# Altium project AD_info.PrjPcb (part 2 of 2)

## Sheet [4] Ports.SchDoc
size A4
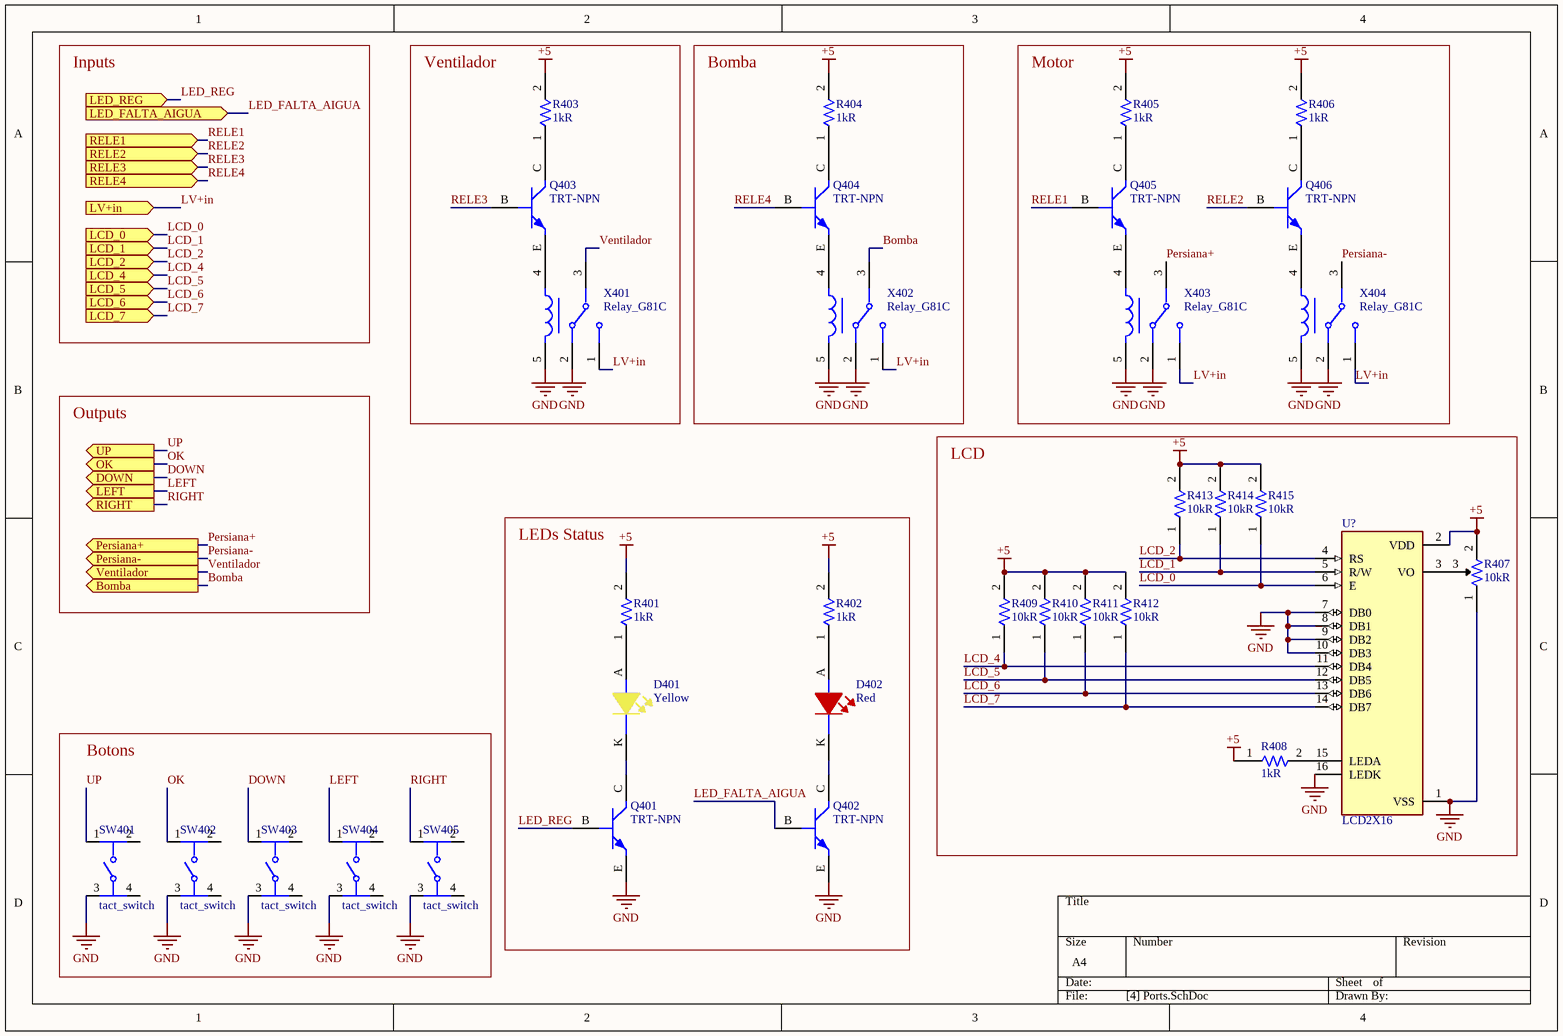
[diagram p4: [4] Ports.SchDoc]

### Parts
D401  Color: Yellow  [LED_3528-WE]  (hidden comment: 150141YS73100)
D402  Color: Red  [LED_3528-WE]  (hidden comment: 150141RS73100)
Q401  TRT-NPN  [TRT-NPN-0.5/45-SOT23]
Q402  TRT-NPN  [TRT-NPN-0.5/45-SOT23]
Q403  TRT-NPN  [TRT-NPN-0.5/45-SOT23]
Q404  TRT-NPN  [TRT-NPN-0.5/45-SOT23]
Q405  TRT-NPN  [TRT-NPN-0.5/45-SOT23]
Q406  TRT-NPN  [TRT-NPN-0.5/45-SOT23]
R401  Resistance: 1kR  [R1206FTK-W]  (hidden comment: ERJT08J102V)
R402  Resistance: 1kR  [R1206FTK-W]  (hidden comment: ERJT08J102V)
R403  Resistance: 1kR  [R1206FTK-W]  (hidden comment: ERJT08J102V)
R404  Resistance: 1kR  [R1206FTK-W]  (hidden comment: ERJT08J102V)
R405  Resistance: 1kR  [R1206FTK-W]  (hidden comment: ERJT08J102V)
R406  Resistance: 1kR  [R1206FTK-W]  (hidden comment: ERJT08J102V)
R407  Resistance: 10kR  [R10k-VTR]  (hidden comment: 3296W-1-103LF)
R408  Resistance: 1kR  [R1206FTK-W]  (hidden comment: ERJT08J102V)
R409  Resistance: 10kR  [R1206FTK-W]  (hidden comment: CRCW120610K0FKEA)
R410  Resistance: 10kR  [R1206FTK-W]  (hidden comment: CRCW120610K0FKEA)
R411  Resistance: 10kR  [R1206FTK-W]  (hidden comment: CRCW120610K0FKEA)
R412  Resistance: 10kR  [R1206FTK-W]  (hidden comment: CRCW120610K0FKEA)
R413  Resistance: 10kR  [R1206FTK-W]  (hidden comment: CRCW120610K0FKEA)
R414  Resistance: 10kR  [R1206FTK-W]  (hidden comment: CRCW120610K0FKEA)
R415  Resistance: 10kR  [R1206FTK-W]  (hidden comment: CRCW120610K0FKEA)
SW401  tact_switch  [FP-PTS647SK38SMTR2LFS-MFG]
SW402  tact_switch  [FP-PTS647SK38SMTR2LFS-MFG]
SW403  tact_switch  [FP-PTS647SK38SMTR2LFS-MFG]
SW404  tact_switch  [FP-PTS647SK38SMTR2LFS-MFG]
SW405  tact_switch  [FP-PTS647SK38SMTR2LFS-MFG]
U?  LCD2X16  [LCD_LCD2X16]
X401  Relay_G81C  [Relay_G81C]
X402  Relay_G81C  [Relay_G81C]
X403  Relay_G81C  [Relay_G81C]
X404  Relay_G81C  [Relay_G81C]

### Blocks framed on the sheet
Ventilador: Q403 R403 X401
Bomba: Q404 R404 X402
Motor: Q405 Q406 R405 R406 X403 X404
LCD: R407-R415 U?
LEDs Status: D401 D402 Q401 Q402 R401 R402
Botons: SW401-SW405

### Ports
Bomba (out, see AD_info[1B]), DOWN (out, see AD_info[1B], [2] MCU[1B]), LCD_0 (in, see AD_info[1B], [2] MCU[1C]), LCD_1 (in, see AD_info[1B], [2] MCU[1C]), LCD_2 (in, see AD_info[1B], [2] MCU[1C]), LCD_4 (in, see AD_info[1B], [2] MCU[1C]), LCD_5 (in, see AD_info[1B], [2] MCU[1C]), LCD_6 (in, see AD_info[1B], [2] MCU[1C]), LCD_7 (in, see AD_info[1B], [2] MCU[1C]), LED_FALTA_AIGUA (in, see AD_info[1B], [2] MCU[1C]), LED_REG (in, see AD_info[1B], [2] MCU[1C]), LEFT (out, see AD_info[1B], [2] MCU[1B]), LV+in (in, see AD_info[1B], [1] Supply[1A]), OK (out, see AD_info[1B], [2] MCU[1B]), Persiana+ (out, see AD_info[1B]), Persiana- (out, see AD_info[1B]), RELE1 (in, see AD_info[1B], [2] MCU[1B]), RELE2 (in, see AD_info[1B]), RELE3 (in, see AD_info[1B]), RELE4 (in, see AD_info[1B]), RIGHT (out, see AD_info[1B], [2] MCU[1B]), UP (out, see AD_info[1B], [2] MCU[1B]), Ventilador (out, see AD_info[1B])

### Nets
+5: R401.2 R402.2 R403.2 R404.2 R405.2 R406.2 R407.2 R408.1 R409.2 R410.2 R411.2 R412.2 R413.2 R414.2 R415.2 U?.2(VDD)  [project net +5V]
GND: Q401.E Q402.E R407.1 SW401.3 SW402.3 SW403.3 SW404.3 SW405.3 U?.1(VSS) U?.7(DB0) U?.8(DB1) U?.9(DB2) U?.10(DB3) U?.16(LEDK) X401.2 X401.5 X402.2 X402.5 X403.2 X403.5 X404.2 X404.5
LV+in: X401.1 X402.1 X403.1 X404.1 ; port LV+in
Bomba: X402.3 ; port Bomba
DOWN: SW403.1 ; port DOWN
LCD_0: R415.1 U?.6(E) ; port LCD_0
LCD_1: R414.1 U?.5(R/W) ; port LCD_1
LCD_2: R413.1 U?.4(RS) ; port LCD_2
LCD_4: R409.1 U?.11(DB4) ; port LCD_4
LCD_5: R410.1 U?.12(DB5) ; port LCD_5
LCD_6: R411.1 U?.13(DB6) ; port LCD_6
LCD_7: R412.1 U?.14(DB7) ; port LCD_7
LED_FALTA_AIGUA: Q402.B ; port LED_FALTA_AIGUA
LED_REG: Q401.B ; port LED_REG
LEFT: SW404.1 ; port LEFT
OK: SW402.1 ; port OK
Persiana+: X403.3 ; port Persiana+
Persiana-: X404.3 ; port Persiana-
RELE1: Q405.B ; port RELE1
RELE2: Q406.B ; port RELE2
RELE3: Q403.B ; port RELE3
RELE4: Q404.B ; port RELE4  [project net RELE2]
RIGHT: SW405.1 ; port RIGHT
UP: SW401.1 ; port UP
Ventilador: X401.3 ; port Ventilador
NetD401_A: D401.A R401.1
NetD401_K: D401.K Q401.C
NetD402_A: D402.A R402.1
NetD402_K: D402.K Q402.C
NetQ403_C: Q403.C R403.1
NetQ403_E: Q403.E X401.4
NetQ404_C: Q404.C R404.1
NetQ404_E: Q404.E X402.4
NetQ405_C: Q405.C R405.1
NetQ405_E: Q405.E X403.4
NetQ406_C: Q406.C R406.1
NetQ406_E: Q406.E X404.4
NetR407_3: R407.3 U?.3(VO)
NetR408_2: R408.2 U?.15(LEDA)

Not connected (* = marked no-connect by the designer): SW401 2 4; SW402 2 4; SW403 2 4; SW404 2 4; SW405 2 4

### Notes on the sheet
- Inputs
- Outputs

### Library data of the parts
D401 = LEDYS-3528-260: Led, Yellow, 590 Nm, 2 V, 30 Ma, 300 Mcd Rohs Compliant: Yes; Manufacturer: Wurth Electronics; Viewing Angle: 120°; Lens Style: Clear,Round; Wavelength: 590nm; Luminous Intensity: 300mcd; Forward Voltage: 2V; Forward Current: 30mA; Test Current: 20mA; .Creator: GP; Category: Diode LED; ComponentLink1Description: Datasheet; ComponentLink1URL: https://www.we-online.com/catalog/datasheet/150141YS73100.pdf; ComponentLink2Description: Where buy it; ComponentLink2URL: https://www.we-online.com/catalog/en/WL-SMTW?sq=150141GS73100#150141GS73100; Supplier 1: RSComponents; Manufacturer Part Number: 150141YS73100; RoHS: Yes; Stock 1: 1; Pricing 1: 100=0,18000, 200=0,17000, 500=0,12400, 1000=0,11900, 2000=0,11200 (USD); Mount: Surface Mount; Case/Package: 3528; Number of Pins: 2; Min Operating Temperature: -40°C; Max Operating Temperature: 85°C; Package Quantity: 2000; Packaging: Tape and Reel; Dominant Wavelength: 590nm; Length: 3.2mm; Width: 2.8mm; Height: 2.1mm; REACH SVHC: Unknown; RoHS Compliant: Yes; Supplier Part Number 1: 8154322
D402 = LEDRS-1411-300: Led, Red, 625 Nm, 2 V, 30 Ma, 300 Mcd Rohs Compliant: Yes; Manufacturer: Wurth Electronics; Luminous Intensity: 300mcd; Viewing Angle: 120°; Forward Voltage: 2V; Lens Style: Clear,Round; Wavelength: 625nm; Forward Current: 30mA; Test Current: 20mA; .Creator: GP; Category: Diode LED; ComponentLink1Description: Datasheet; ComponentLink1URL: https://www.we-online.com/catalog/datasheet/150141RS73100.pdf; ComponentLink2Description: Where buy it; ComponentLink2URL: https://www.we-online.com/catalog/en/WL-SMTW?sq=150141RS73100#150141RS73100; Supplier 1: Digi-Key; Manufacturer Part Number: 150141RS73100; RoHS: Yes; Stock 1: 6040; Pricing 1: 1=0,19000, 50=0,18200, 100=0,15800, 500=0,12100 (USD); Mount: Surface Mount; Case/Package: 3528; Case Code (Metric): 3528; Case Code (Imperial): 1411; Min Operating Temperature: -40°C; Max Operating Temperature: 85°C; Package Quantity: 2000; Packaging: Tape and Reel; Dominant Wavelength: 625nm; Length: 3.5mm; Width: 2.8mm; Height: 1.9mm; RoHS Compliant: Yes; REACH SVHC: Unknown; Supplier Part Number 1: 732-5000-1-ND
Q401-Q406 = CMP-00148-1: ON Semi BC817-25LT1G NPN Bipolar Transistor; 0.5 A; 45 V; 3-Pin SOT-23; Current Rating: 500mA; Collector-emitter Voltage-Max: 700mV; Gain Bandwidth Product: 100MHz; Element Configuration: Single; hFE Min: 160; Collector Emitter Voltage (VCEO): 45V; Emitter Base Voltage (VEBO): 5V; Collector Base Voltage (VCBO): 50V; Power Dissipation: 300mW; .Creator: GP; Number of Elements: 1; ComponentLink2URL: *; Packaging: *; ComponentLink14Description: https://datasheet.ciiva.com/976/bc817-16lt1-d-976357.pdf?src-supplier=Digi-Key; Radiation Hardening: No; Pricing 1: 1=0,20000, 10=0,18500, 100=0,10080, 500=0,06204, 1000=0,04229 (USD); ComponentLink9URL: https://datasheet.ciiva.com/4722/bc817-16lt1-d-104560-4722229.pdf?src-supplier=Mouser; Vce max: *; Gain: *; Max Power Dissipation: *; ComponentLink5URL: https://datasheet.ciiva.com/1196/bc817-16lt1-d-1196558.pdf?src-supplier=Element14; ComponentLink16URL: https://datasheet.ciiva.com/976/bc817-16lt1-d-976356.pdf?src-supplier=Digi-Key; Contact Plating: Tin,Matte; Max Operating Temperature: *; Package: *; Width: 1.3mm; ComponentLink2Description: Where buy it; ComponentLink15URL: https://datasheet.ciiva.com/976/bc817-16lt1-d-976358.pdf?src-supplier=Digi-Key; Package Quantity: 1; RoHS: *; Collector Emitter Saturation Voltage: 700mV; Transition Frequency: 100MHz; ComponentLink7URL: https://datasheet.ciiva.com/22664/bc817-16lt1-d-22664204.pdf?src-supplier=Element14; ComponentLink10URL: https://datasheet.ciiva.com/1195/bc817-16lt1-d-1195763.pdf?src-supplier=Element14; Design Item ID: TRT-NPN-0.5/45-SOT23; Series: -; ComponentLink8URL: https://datasheet.ciiva.com/22664/1842041-22664101.pdf?src-supplier=Element14; Lead Free: Lead Free; ComponentLink4Description: https://datasheet.ciiva.com/15138/getdatasheetpartid-38405-15138602.pdf?src-supplier=Verical; ComponentLink12Description: https://datasheet.ciiva.com/11197/bc817-16lt1-d-11197514.pdf?src-supplier=Avnet; ComponentLink11Description: https://datasheet.ciiva.com/1195/bc817-16lt1-d-1195764.pdf?src-supplier=Element14; Max Frequency: 100MHz; ComponentLink13URL: https://datasheet.ciiva.com/25996/bc817-16lt1-d-25996327.pdf?src-supplier=Avnet+Europe; Max Breakdown Voltage: 45V; Polarity: *; ComponentLink6URL: https://datasheet.ciiva.com/22641/bc817-16lt1-d-22641013.pdf?src-supplier=Farnell; ComponentLink4URL: https://datasheet.ciiva.com/15138/getdatasheetpartid-38405-15138602.pdf?src-supplier=Verical; Height: 0.94mm; Power rating: *; Source: Semiconductor.SchLib; Max Collector Current: 500mA; ComponentLink15Description: https://datasheet.ciiva.com/976/bc817-16lt1-d-976358.pdf?src-supplier=Digi-Key; ComponentLink11URL: https://datasheet.ciiva.com/1195/bc817-16lt1-d-1195764.pdf?src-supplier=Element14; REACH SVHC: No SVHC; Number of Pins: 3; Manufacturer Part Number: *; Case/Package: SOT-23-3; ComponentLink1Description: Datasheet; RoHS Compliant: Yes; Collector Emitter Breakdown Voltage: 45V; Halogen Free: Halogen Free; Frequency: 100MHz; ComponentLink3Description: https://datasheet.ciiva.com/27748/2010413-27748829.pdf?src-supplier=Jameco; ComponentLink3URL: https://datasheet.ciiva.com/27748/2010413-27748829.pdf?src-supplier=Jameco; ComponentLink9Description: https://datasheet.ciiva.com/4722/bc817-16lt1-d-104560-4722229.pdf?src-supplier=Mouser; Category: Transistor; Type: *; ComponentLink8Description: https://datasheet.ciiva.com/22664/1842041-22664101.pdf?src-supplier=Element14; ComponentLink10Description: https://datasheet.ciiva.com/1195/bc817-16lt1-d-1195763.pdf?src-supplier=Element14; ComponentLink1URL: *; ComponentLink16Description: https://datasheet.ciiva.com/976/bc817-16lt1-d-976356.pdf?src-supplier=Digi-Key; Manufacturer: *; ComponentLink12URL: https://datasheet.ciiva.com/11197/bc817-16lt1-d-11197514.pdf?src-supplier=Avnet; ComponentLink6Description: https://datasheet.ciiva.com/22641/bc817-16lt1-d-22641013.pdf?src-supplier=Farnell; ComponentLink13Description: https://datasheet.ciiva.com/25996/bc817-16lt1-d-25996327.pdf?src-supplier=Avnet+Europe; Ic max: *; ComponentLink14URL: https://datasheet.ciiva.com/976/bc817-16lt1-d-976357.pdf?src-supplier=Digi-Key; Length: 2.9mm; ComponentLink5Description: https://datasheet.ciiva.com/1196/bc817-16lt1-d-1196558.pdf?src-supplier=Element14; Min Operating Temperature: *; ComponentLink7Description: https://datasheet.ciiva.com/22664/bc817-16lt1-d-22664204.pdf?src-supplier=Element14
R401-R406 R408 = R1k-1206FTK: Res Thick Film 1206 1K Ohm 5% 0.33W(1/3W) ±200ppm/C Pad SMD Automotive T/R; Manufacturer: Panasonic; Temperature Coefficient: 200ppm/°C; Power Rating: 330mW; Voltage Rating: 200V; Max Power Dissipation: 333mW; .Creator: GP; Category: Resistor; ComponentLink1Description: Datasheet; ComponentLink1URL: https://docs.rs-online.com/ef78/0900766b812cb812.pdf; ComponentLink2Description: Where buy it; ComponentLink2URL: https://es.rs-online.com/web/p/resistencias-de-montaje-en-superficie/7218936; Supplier 1: RSComponents; Manufacturer Part Number: ERJT08J102V; RoHS: Yes; Stock 1: 1; Pricing 1: 5=0,32200, 50=0,30000, 100=0,28100, 250=0,25900, 500=0,23800 (USD); Mount: Surface Mount; Case/Package: 1206; Number of Pins: 2; Contact Plating: Tin; Case Code (Metric): 3216; Case Code (Imperial): 1206; Min Operating Temperature: -55°C; Max Operating Temperature: 155°C; Tolerance: 5%; Resistor Type: Thick Film; Package Quantity: 5000; Packaging: Tape and Reel; Number of Terminations: 2; Voltage Rating (DC): 200V; Termination: Tab; Features: Automotive AEC-Q200; Length: 3.2mm; Width: 0.063inch; Height: 0.6mm; Depth: 1.6mm; Radiation Hardening: No; REACH SVHC: No SVHC; Military Standard: Not; RoHS Compliant: Yes; Supplier Part Number 1: 7218936
R407 = R10k-VTR: Trimmer, Cermet, Rest 10 Kilohms, PCB, 25 Turns, Pwr-Rtg 0.5W, 3296 Series; Manufacturer: Bourns; Tolerance: 10%; Power Rating: 500mW; Number of Turns: 25; Temperature Coefficient: 100ppm/°C; Insulation Resistance: 1GR; .Creator: DO; Supplier 1: RSComponents; Manufacturer Part Number: 3296W-1-103LF; RoHS: Yes; Category: Variable Resistors and Potentiometers; Stock 1: 3300; Pricing 1: 50=2,54800, 100=2,31900, 200=2,14000, 300=1,88400, 500=1,55300 (USD); Mount: PCB,Through Hole; Weight: 0.03oz; Color: Blue; Contact Plating: Tin,Matte; Min Operating Temperature: -55°C; Max Operating Temperature: 125°C; Packaging: Rail/Tube; Package Quantity: 50; Termination: Pin; Resistor Type: Cermet; Technology: CERMET; Taper: Linear; Max Power Dissipation: 500mW; Series: 3296; Resistance Tolerance: 10%; Length: 9.53mm; Width: 9.53mm; Height: 0.395inch; Depth: 4.83mm; Radiation Hardening: No; REACH SVHC: No SVHC; Military Standard: Not; Lead Free: Lead Free; RoHS Compliant: Yes; ComponentLink1URL: https://datasheet.ciiva.com/19454/853572-19454866.pdf?src-supplier=Jameco; ComponentLink1Description: https://datasheet.ciiva.com/19454/853572-19454866.pdf?src-supplier=Jameco; ComponentLink2URL: https://datasheet.ciiva.com/11830/0900766b8069ccf4-11830871.pdf?src-supplier=RSComponents; ComponentLink2Description: https://datasheet.ciiva.com/11830/0900766b8069ccf4-11830871.pdf?src-supplier=RSComponents; ComponentLink3URL: https://datasheet.ciiva.com/29122/447277-da-01-en-trimmer-tht3296w-1-103lf-10k-0-5w-29122362.pdf?src-supplier=Conrad; ComponentLink3Description: https://datasheet.ciiva.com/29122/447277-da-01-en-trimmer-tht3296w-1-103lf-10k-0-5w-29122362.pdf?src-supplier=Conrad; ComponentLink4URL: https://datasheet.ciiva.com/26913/3296w-1-103lf-26913885.pdf?src-supplier=IIIC; ComponentLink4Description: https://datasheet.ciiva.com/26913/3296w-1-103lf-26913885.pdf?src-supplier=IIIC; ComponentLink5URL: https://datasheet.ciiva.com/1131/1815117-1131273.pdf?src-supplier=Element14; ComponentLink5Description: https://datasheet.ciiva.com/1131/1815117-1131273.pdf?src-supplier=Element14; ComponentLink6URL: https://datasheet.ciiva.com/18411/70153578-18411561.pdf?src-supplier=Allied+Electronics; ComponentLink6Description: https://datasheet.ciiva.com/18411/70153578-18411561.pdf?src-supplier=Allied+Electronics; ComponentLink7URL: https://datasheet.ciiva.com/3266/3296-3266187.pdf?src-supplier=Avnet; ComponentLink7Description: https://datasheet.ciiva.com/3266/3296-3266187.pdf?src-supplier=Avnet; ComponentLink8URL: https://datasheet.ciiva.com/30093/3296-30093899.pdf?src-supplier=Onlinecomponents.com; ComponentLink8Description: https://datasheet.ciiva.com/30093/3296-30093899.pdf?src-supplier=Onlinecomponents.com; ComponentLink9URL: https://datasheet.ciiva.com/2156/3296-2156893.pdf?src-supplier=Digi-Key; ComponentLink9Description: https://datasheet.ciiva.com/2156/3296-2156893.pdf?src-supplier=Digi-Key; ComponentLink10URL: https://datasheet.ciiva.com/14173/ew3296-dat-e-14173022.pdf?src-supplier=Distrelec; ComponentLink10Description: https://datasheet.ciiva.com/14173/ew3296-dat-e-14173022.pdf?src-supplier=Distrelec; Supplier Part Number 1: 1673377; ComponentLink11Description: Where buy it; ComponentLink11URL: https://es.rs-online.com/web/p/potenciometros-de-ajuste/5219647
R409-R415 = R10k-1206FTK: Res Thick Film 1206 10K Ohm 1% 0.25W(1/4W) +/-100ppm/ßC Pad SMD Automotive T/R; Temperature Coefficient: 100ppm/°C; Voltage Rating: 200V; .Creator: GP; Category: Resistor; ComponentLink1Description: Datasheet; ComponentLink1URL: https://docs.rs-online.com/bca8/A700000006404581.pdf; ComponentLink2Description: Where buy it; ComponentLink2URL: https://es.rs-online.com/web/p/resistencias-de-montaje-en-superficie/6791765; Supplier 1: Allied Electronics; Case/Package: 1206; Number of Pins: 2; Contact Plating: Tin; Weight: 0.000353oz; Case Code (Metric): 3216; Case Code (Imperial): 1206; Package Shape: Rectangular; Size Code: 1206; Terminal Finish: Tin; Resistor Type: Thick Film; Package Quantity: 10; Number of Terminations: 2; Termination: SMD/SMT; Voltage Rating (DC): 200V; Features: Automotive AEC-Q200; Series: CRCW; Construction: Rectangular; Resistance Tolerance: 1%; Working Voltage: 200V; Length: 3.2mm; Width: 0.063inch; Height: 0.55mm; Depth: 1.6mm; Radiation Hardening: No; Lead Free: Lead Free; RoHS Compliant: Yes; REACH SVHC: Unknown; Military Standard: Not; Supplier Part Number 1: 70201262
SW401-SW405 = CMP-00028-00009-1: Keypad Switch, 1 Switches, SPST, Momentary-tactile, 0.05A, 12VDC, 2.94N, Solder Terminal, Surface Mount-straight; RoHS Compliant: Yes
U? = LCD2X16: Display; Display: LCD 2x16 characters (blue backlight); MF: mikroElektronika; SnapEDA_Link: https://www.snapeda.com/parts/LCD%202X16/mikroElektronika/view-part/?ref=snap; Package: TQFP-64 mikroElektronika; Value: *; MP: LCD 2X16; Check_prices: https://www.snapeda.com/parts/LCD%202X16/mikroElektronika/view-part/?ref=eda
X401-X404 = CMP-00037-1: G81C335 High Voltage Relay; Manufacturer: Gigavac; Design Item ID: Relay_G81C; RoHS Compliant: Yes; RoHS: Yes; Manufacturer Part Number: G81C335; Source: Electromechanical.SchLib

## Nets that join several sheets
+5V: [1] Supply (J101.1 J102.1 R101.2), [2] MCU (6 pins), [3] ADC (11 pins), [4] Ports (16 pins)
GND: AD_info (13 pins), [1] Supply (C101.1 C102.1 D101.K U101.2), [2] MCU (13 pins), [3] ADC (8 pins), [4] Ports (22 pins)
LV+in: AD_info (J1.1), [1] Supply (C101.2 U101.1), [4] Ports (X401.1 X402.1 X403.1 X404.1)
+LV_USB: AD_info (J7.1), [1] Supply (J102.2)
Bomba: AD_info (J6.1), [4] Ports (X402.3)
CLK: [2] MCU (U201.60), [3] ADC (R305.2 U301.11)
CS: [2] MCU (U201.54), [3] ADC (R306.2 U301.8)
D+: AD_info (J7.2), [2] MCU (R201.2)
D-: AD_info (J7.3), [2] MCU (R202.2)
DOWN: [2] MCU (U201.28), [4] Ports (SW403.1)
ECHO: AD_info (J3.2), [2] MCU (U201.8)
FC_Inf: AD_info (J4.2), [2] MCU (U201.35)
FC_Sup: AD_info (J4.1), [2] MCU (U201.31)
HUM_T: AD_info (J2.3), [3] ADC (U301.3)
LCD_0: [2] MCU (U201.55), [4] Ports (R415.1 U?.6)
LCD_1: [2] MCU (U201.46), [4] Ports (R414.1 U?.5)
LCD_2: [2] MCU (U201.45), [4] Ports (R413.1 U?.4)
LCD_4: [2] MCU (U201.40), [4] Ports (R409.1 U?.11)
LCD_5: [2] MCU (U201.38), [4] Ports (R410.1 U?.12)
LCD_6: [2] MCU (U201.37), [4] Ports (R411.1 U?.13)
LCD_7: [2] MCU (U201.36), [4] Ports (R412.1 U?.14)
LED_FALTA_AIGUA: [2] MCU (U201.57), [4] Ports (Q402.B)
LED_REG: [2] MCU (U201.56), [4] Ports (Q401.B)
LEFT: [2] MCU (U201.29), [4] Ports (SW404.1)
MISO: [2] MCU (U201.59), [3] ADC (R304.1 U301.10)
MOSI: [2] MCU (U201.61), [3] ADC (R303.1 U301.9)
NTC_H: AD_info (J2.1), [3] ADC (C301.2 R301.1 U301.1)
NTC_T: AD_info (J2.2), [3] ADC (C302.2 R302.1 U301.2)
OK: [2] MCU (U201.27), [4] Ports (SW402.1)
Persiana+: AD_info (J4.3), [4] Ports (X403.3)
Persiana-: AD_info (J4.4), [4] Ports (X404.3)
RELE1: [2] MCU (U201.58), [4] Ports (Q405.B)
RELE2: [2] MCU (U201.2), [4] Ports (Q404.B)
RELE2: [2] MCU (U201.3), [4] Ports (Q406.B)
RELE3: [2] MCU (U201.4), [4] Ports (Q403.B)
RIGHT: [2] MCU (U201.30), [4] Ports (SW405.1)
TRIG: AD_info (J3.1), [2] MCU (U201.7)
UP: [2] MCU (U201.14), [4] Ports (SW401.1)
Ventilador: AD_info (J5.1), [4] Ports (X401.3)